# EasyEDA Pro project HILOW_Drivers.eprj

# Schematic HILOW_Drivers
Create Date: 2024-08-06; Page Name: P1; Project Name: HILOW_Drivers; Schematic Name: HILOW_Drivers; Update Date: 2024-08-06; Company: EasyEDA.com; Drawn: EasyEDA; Page Size: A4; Part Number: JLCPCB-002; Reviewed: EasyEDA; Version: V0.1
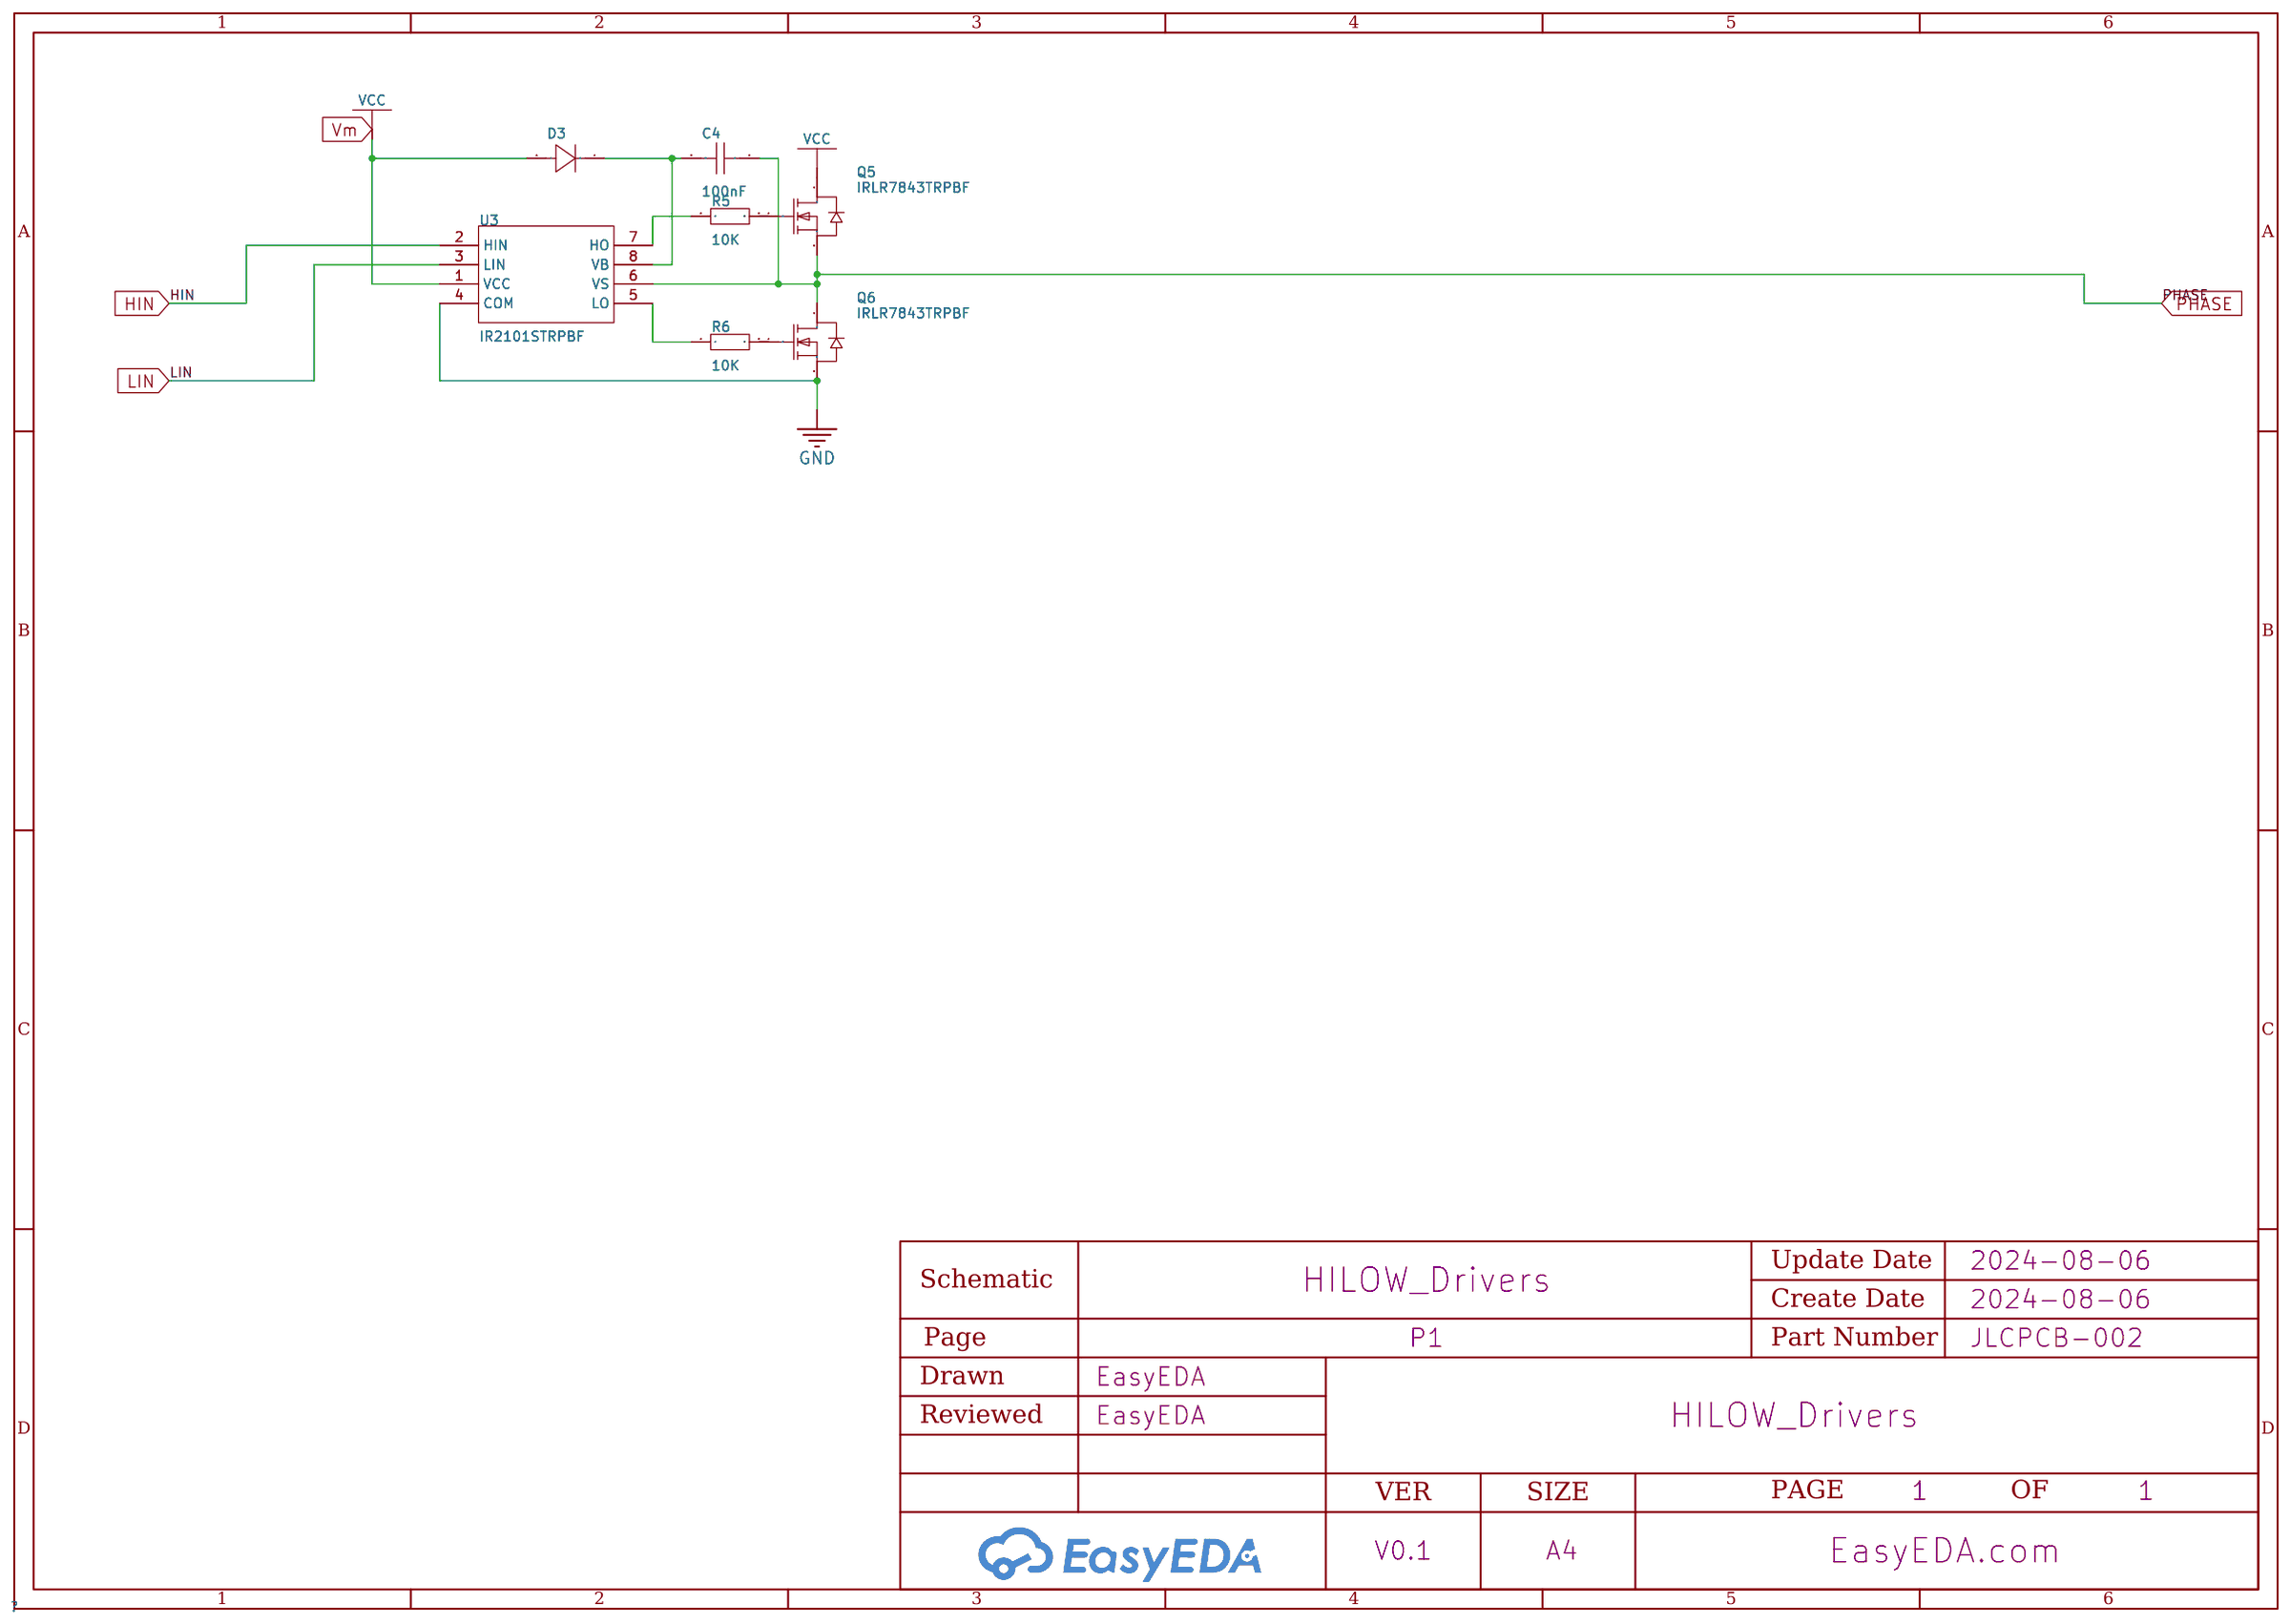
[diagram p0: schematic sheet]

## Parts
C4  100nF  [C0603]
D3  -  [DO-41_BD2.4-L4.7-P8.70-D0.9-RD]
Q5  IRLR7843TRPBF  [TO-252-2_L6.5-W6.1-P4.58-LS10.0-TR]
Q6  IRLR7843TRPBF  [TO-252-2_L6.5-W6.1-P4.58-LS10.0-TR]
R5  10K  [R0603]
R6  10K  [R0603]
U3  IR2101STRPBF  [SOIC-8_L5.0-W4.0-P1.27-LS6.0-BL]

## Library data of the parts
C4 = CAP_0603: Supplier Footprint: 0603
D3 = 1N4007: Supplier Footprint: DO-41
Q5 Q6 = IRLR7843TRPBF_C21988: Type:1个NChannel Drain Source Voltage (Vdss): Continuous Drain Current (Id): Power Dissipation (Pd): Drain Source On Resistance (RDS(on)@Vgs,Id):3.3mΩ@10V,15A Gate Threshold Voltage (Vgs(th)@Id):2.3V@250uA Total Gate Charge (Qg@Vgs):50nC@4.5V Input Capacit; LCSC Part Name: 1个N沟道 耐压:30V 电流:161A; Supplier Part: C21988; Manufacturer: Infineon(英飞凌); Supplier Footprint: TO-252-2(DPAK); JLCPCB Part Class: Extended Part; Datasheet: https://atta.szlcsc.com/upload/public/pdf/source/20140314/1457707013919.pdf; Supplier: LCSC; Type: 1个NChannel; Drain Source On Resistance (RDS(on)@Vgs,Id): 3.3mΩ@10V,15A; Gate Threshold Voltage (Vgs(th)@Id): 2.3V@250uA; Total Gate Charge (Qg@Vgs): 50nC@4.5V; Input Capacitance (Ciss@Vds): 4.38nF@15V; Operating Temperature: -55℃~+175℃@(Tj)
R5 R6 = Res_0603: Supplier Footprint: 0603
U3 = IR2101STRPBF: Driven Configuration:Half Bridge Load Type:MOSFET；IGBT Number of Drivers:2 Peak Output Current(sink):360mA Peak Output Current(source):210mA Supply Voltage:10V~20V Supply Voltage:10V~20V Rise Time:100ns Fall Time:50ns Operating Temperature:-40℃~+150℃@(Tj); Supplier Part: C2956; Manufacturer: Infineon(英飞凌); Supplier Footprint: SOIC-8; JLCPCB Part Class: Extended Part; Datasheet: https://atta.szlcsc.com/upload/public/pdf/source/20180112/C152687_15157257779631261587.pdf; Supplier: LCSC; Driven Configuration: Half Bridge; Load Type: MOSFET；IGBT; Number of Drivers: 2; Peak Output Current(sink): 360mA; Peak Output Current(source): 210mA; Supply Voltage: 10V~20V; Rise Time: 100ns; Fall Time: 50ns; Operating Temperature: -40℃~+150℃@(Tj)

## Nets
GND: Q6.3(S) U3.4(COM)
VCC: D3.2(A) Q5.4(D) U3.1(VCC)
HIN: U3.2(HIN)
LIN: U3.3(LIN)
PHASE: C4.1 Q5.3(S) Q6.4(D) U3.6(VS)
$1N986: Q6.1(G) R6.2
$1N988: Q5.1(G) R5.2
Net-(C4-2): C4.2 D3.1(K) U3.8(VB)
Net-(R5-1): R5.1 U3.7(HO)
Net-(R6-1): R6.1 U3.5(LO)

# Board HILOW_Drivers
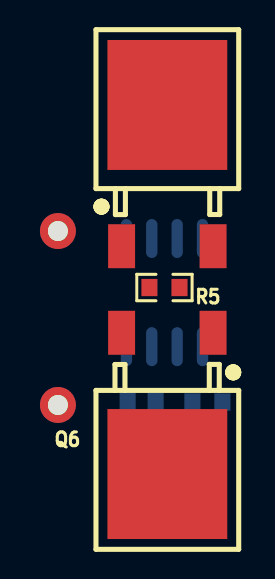
[diagram p1: board, top side]
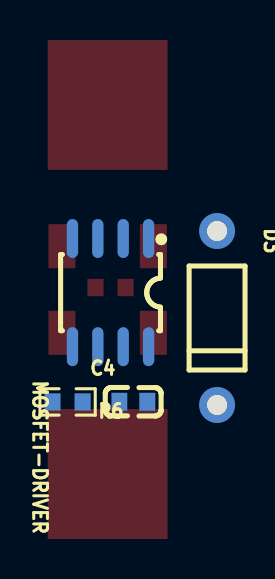
[diagram p2: board, bottom side, seen from below]

No outline. copper layers: Top Layer, Bottom Layer. Coordinates in mm from the lowest, leftmost part position.
Stack: Top Layer 0.035mm / Dielectric1 1.51mm FR4 er 4.5 / Bottom Layer 0.035mm

## Design rules (mm)
template: JLCPCB Capability(Two Layers Board)
spacing copperThickness1oz (default): track to track 0.102, other pairs 0.152 to 0.3
spacing copperThickness2oz: track to track 0.203, other pairs 0.152 to 0.3
track width copperThickness1oz (default): min 0.127, default 0.254, max 2.54
track width copperThickness2oz: min 0.203, default 0.254, max 2.54
differential pair differentialPair (default): width min 0.127, default 0.254, max 2.54; gap min 0.152, default 0.152
via viaSize (default): diameter min 0.5, default 0.61, max 10; hole min 0.3, default 0.305, max 6.3

## Placement (name value [footprint] x y rotation side)
C4  100nF  [C0603]  4.19 0.08 180 bottom
D3  -  [DO-41_BD2.4-L4.7-P8.70-D0.9-RD]  0 4.27 90 bottom
MOSFET-DRIVER  IR2101STRPBF  [SOIC-8_L5.0-W4.0-P1.27-LS6.0-BL]  5.33 5.54 0 bottom
Q5  IRLR7843TRPBF  [TO-252-2_L6.5-W6.1-P4.58-LS10.0-TR]  5.48 11.4 180 top
Q6  IRLR7843TRPBF  [TO-252-2_L6.5-W6.1-P4.58-LS10.0-TR]  5.48 0 0 top
R5  10K  [R0603]  5.33 5.8 180 top
R6  10K  [R0603]  7.48 0.07 0 bottom

## Footprints (pads in the part's own frame, mm; a bottom-side part is the same pattern mirrored in y, then rotated)
C0603
  rect 0.8x0.9 smd: 1(-0.7,0) 2(0.7,0)
DO-41_BD2.4-L4.7-P8.70-D0.9-RD
  round 1.8 hole 1: 1(-4.35,0) 2(4.35,0)
R0603
  rect 0.806x0.864 smd: 1(-0.753,0) 2(0.753,0)
SOIC-8_L5.0-W4.0-P1.27-LS6.0-BL
  oval 0.569x1.95 smd: 1(-1.905,-2.705) 2(-0.635,-2.705) 3(0.635,-2.705) 4(1.905,-2.705) 5(1.905,2.705) 6(0.635,2.705) 7(-0.635,2.705) 8(-1.905,2.705)
TO-252-2_L6.5-W6.1-P4.58-LS10.0-TR
  rect 1.35x2.2 smd: 1(2.29,3.533) 3(-2.29,3.533)
  rect 6x6.5 smd: 4(0,-3.533)

## Nets
GND: MOSFET-DRIVER.4 Q6.3
VCC: D3.2 MOSFET-DRIVER.1 Q5.4
$1N986: Q6.1 R6.2
$1N988: Q5.1 R5.2
$1N990: MOSFET-DRIVER.7 R5.1
$1N993: MOSFET-DRIVER.5 R6.1
$1N1007: C4.2 D3.1 MOSFET-DRIVER.8
$1N1012: MOSFET-DRIVER.3
$1N1014: MOSFET-DRIVER.2
$1N1016: C4.1 MOSFET-DRIVER.6 Q5.3 Q6.4
